# EAGLE schematic schema_electrica (EAGLE 8.2.0)
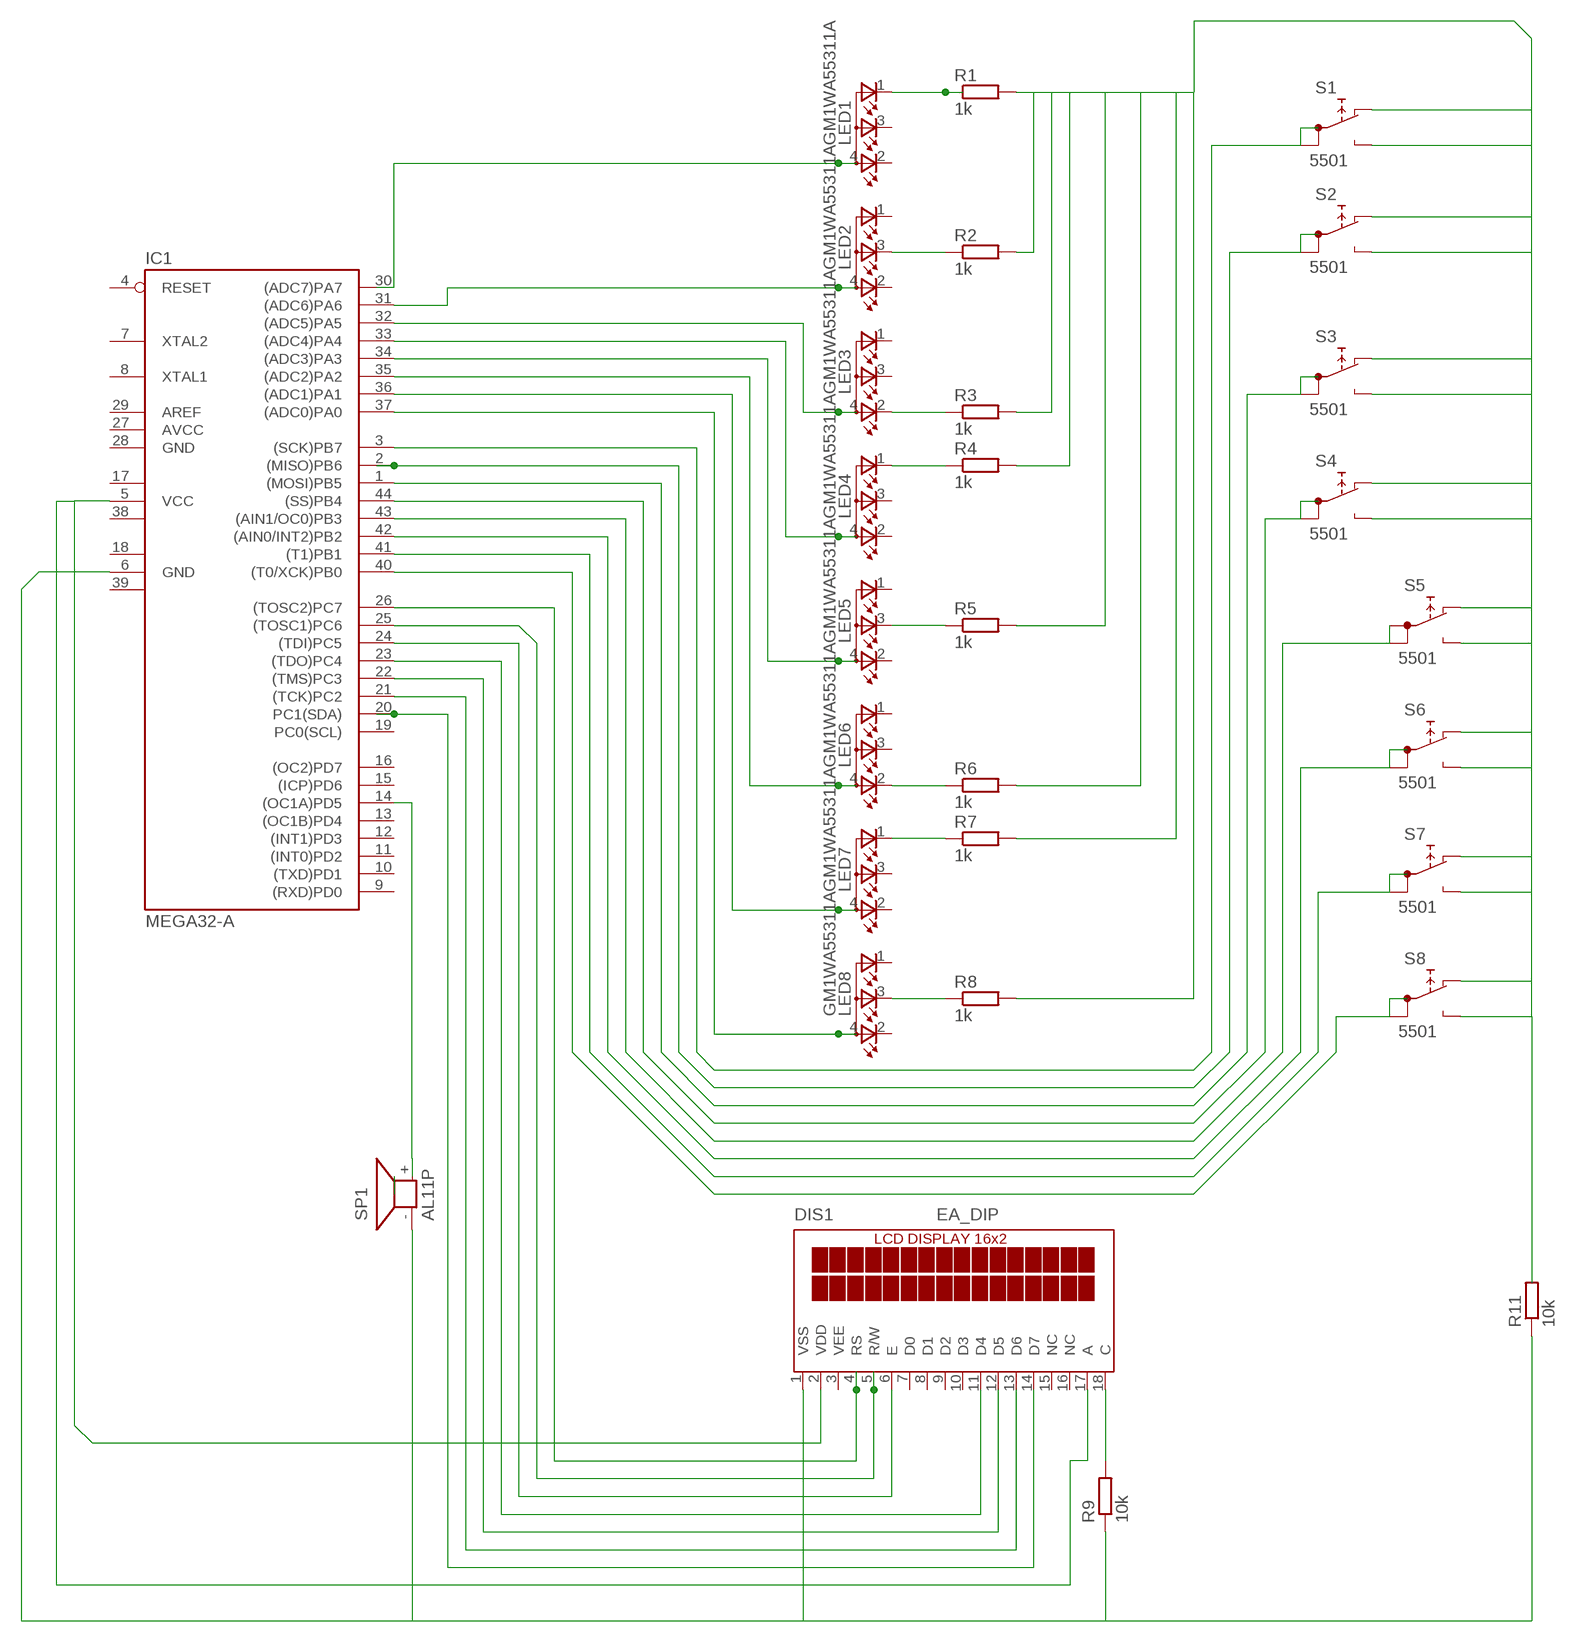
[diagram p0: schematic, sheet 1]

## Parts
DIS1  EA_DIP  [EA_DIP]
IC1  MEGA32-A  [TQFP44]
LED1  GM1WA55311A  [GM1WA55311A]
LED2  GM1WA55311A  [GM1WA55311A]
LED3  GM1WA55311A  [GM1WA55311A]
LED4  GM1WA55311A  [GM1WA55311A]
LED5  GM1WA55311A  [GM1WA55311A]
LED6  GM1WA55311A  [GM1WA55311A]
LED7  GM1WA55311A  [GM1WA55311A]
LED8  GM1WA55311A  [GM1WA55311A]
R1  1k  R-EU_VMTB60  [VMTB60]
R2  1k  R-EU_VMTB60  [VMTB60]
R3  1k  R-EU_VMTB60  [VMTB60]
R4  1k  R-EU_VMTB60  [VMTB60]
R5  1k  R-EU_VMTB60  [VMTB60]
R6  1k  R-EU_VMTB60  [VMTB60]
R7  1k  R-EU_VMTB60  [VMTB60]
R8  1k  R-EU_VMTB60  [VMTB60]
R9  10k  R-EU_0204/2V  [0204V]
R11  10k  R-EU_0204/2V  [0204V]
S1  5501  [5501]
S2  5501  [5501]
S3  5501  [5501]
S4  5501  [5501]
S5  5501  [5501]
S6  5501  [5501]
S7  5501  [5501]
S8  5501  [5501]
SP1  AL11P  [AL11P]

## Nets
N$1: IC1.30((ADC7)PA7) LED1.4(A)
N$2: IC1.31((ADC6)PA6) LED2.4(A)
N$3: IC1.32((ADC5)PA5) LED3.4(A)
N$4: IC1.33((ADC4)PA4) LED4.4(A)
N$5: IC1.34((ADC3)PA3) LED5.4(A)
N$6: IC1.35((ADC2)PA2) LED6.4(A)
N$7: IC1.36((ADC1)PA1) LED7.4(A)
N$8: IC1.37((ADC0)PA0) LED8.4(A)
N$9: LED1.1(CGREEN) R1.1
N$10: LED2.3(CBLUE) R2.1
N$11: LED3.2(CRED) R3.1
N$12: LED4.1(CGREEN) R4.1
N$13: LED5.3(CBLUE) R5.1
N$14: LED6.2(CRED) R6.1
N$15: LED7.1(CGREEN) R7.1
N$16: LED8.3(CBLUE) R8.1
N$17: IC1.14((OC1A)PD5) SP1.+
N$18: IC1.3((SCK)PB7) S1.1A S1.1B
N$19: IC1.2((MISO)PB6) S2.1A S2.1B
N$20: IC1.1((MOSI)PB5) S3.1A S3.1B
N$21: IC1.44((SS)PB4) S4.1A S4.1B
N$22: IC1.43((AIN1/OC0)PB3) S5.1A S5.1B
N$23: IC1.42((AIN0/INT2)PB2) S6.1A S6.1B
N$24: IC1.41((T1)PB1) S7.1A S7.1B
N$25: IC1.40((T0/XCK)PB0) S8.1A S8.1B
N$26: DIS1.14(D7) IC1.20(PC1(SDA))
N$27: DIS1.13(D6) IC1.21((TCK)PC2)
N$28: DIS1.12(D5) IC1.22((TMS)PC3)
N$29: DIS1.11(D4) IC1.23((TDO)PC4)
N$30: DIS1.6(E) IC1.24((TDI)PC5)
N$31: DIS1.5(R/W) IC1.25((TOSC1)PC6)
N$32: DIS1.4(RS) IC1.26((TOSC2)PC7)
N$33: DIS1.2(VDD) DIS1.17(A) IC1.5(VCC)
N$35: R1.2 R2.2 R3.2 R4.2 R5.2 R6.2 R7.2 R8.2 R11.2 S1.NC S1.NO S2.NC S2.NO S3.NC S3.NO S4.NC S4.NO S5.NC S5.NO S6.NC S6.NO S7.NC S7.NO S8.NC S8.NO
N$36: DIS1.18(C) R9.2
N$37: DIS1.1(VSS) IC1.6(GND) R9.1 R11.1 SP1.-
Unconnected: DIS1.7(D0) DIS1.8(D1) DIS1.9(D2) DIS1.10(D3) DIS1.15(NC) DIS1.16(NC) IC1.4(RESET) IC1.7(XTAL2) IC1.8(XTAL1) IC1.9((RXD)PD0) IC1.10((TXD)PD1) IC1.11((INT0)PD2) IC1.12((INT1)PD3) IC1.13((OC1B)PD4) IC1.15((ICP)PD6) IC1.16((OC2)PD7) IC1.19(PC0(SCL)) IC1.29(AREF) LED1.2(CRED) LED1.3(CBLUE) LED2.1(CGREEN) LED2.2(CRED) LED3.1(CGREEN) LED3.3(CBLUE) LED4.2(CRED) LED4.3(CBLUE) LED5.1(CGREEN) LED5.2(CRED) LED6.1(CGREEN) LED6.3(CBLUE) LED7.2(CRED) LED7.3(CBLUE) LED8.1(CGREEN) LED8.2(CRED)

## Power pins joined to a net without a drawn wire
AVCC: IC1.27(AVCC)
GND: IC1.28(GND)
GND1: IC1.18(GND1)
GND2: IC1.39(GND2)
VCC1: IC1.17(VCC1)
VCC2: IC1.38(VCC2)
VEE: DIS1.3(VEE)

## Library data of the parts
DIS1 = display-lcd:EA_DIP: LCD-MODUL 2x16 - 6,68mm, INKL. KONTROLLER HD44780 Source: Data sheet <http://www.lcd-module.de/pdf/doma/dip162-d.pdf>
IC1 = atmel:MEGA32: MICROCONTROLLER 32 Kbytes FLASH 2 Kbytes SRAM 1 Kbytes EEPROM USART 8-channel 10 bit ADC Source: www.atmel.com .. doc2503.pdf; MPN: ATMEGA32-16AU; OC_FARNELL: 9171274; OC_NEWARK: 69K6677
LED1-LED8 = led:GM1WA55311A: Chip LED RGB Source: http://document.sharpsma.com/files/GM1WA55311A_SS.pdf
R1-R9 R11 = resistor:R-EU_: RESISTOR, European symbol
S1-S8 = switch:55?: PUSHBUTTON SERIES 5500 SWITCHES Source: www.e-switch.com .. 5500.pdf
SP1 = buzzer:AL11P: SPEAKER Source: Buerklin; OC_FARNELL: unknown; OC_NEWARK: unknown